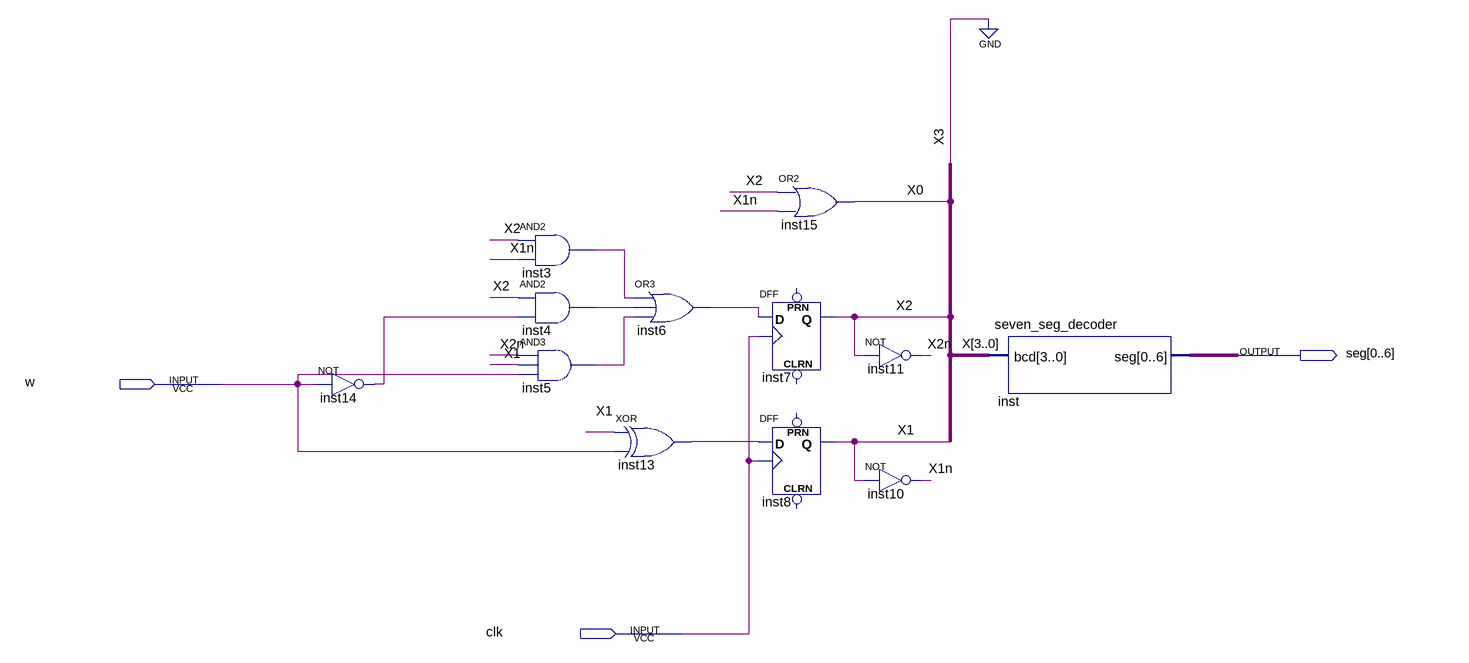
[diagram p0: schematic sheet]
// Quartus schematic lab11partb.bdf as structural Verilog: 12 symbols, 3 pins
module lab11partb (
  input  w,
  input  clk,
  output [0:6] seg
);

  wire inst3_out, inst4_out, inst5_out, inst6_out, inst13_out, inst14_out, X1n, X2n;
  wire [2:0] X;

  not inst14 (inst14_out, w);
  and inst3 (inst3_out, X[2], X1n);
  and inst4 (inst4_out, X[2], inst14_out);
  and inst5 (inst5_out, X2n, X[1], w);
  or inst6 (inst6_out, inst3_out, inst4_out, inst5_out);
  xor inst13 (inst13_out, X[1], w);
  DFF inst7 (.CLK(clk), .D(inst6_out), .Q(X[2]));  // open: CLRN, PRN
  DFF inst8 (.CLK(clk), .D(inst13_out), .Q(X[1]));  // open: CLRN, PRN
  or inst15 (X[0], X[2], X1n);
  not inst11 (X2n, X[2]);
  not inst10 (X1n, X[1]);
  seven_seg_decoder inst (.bcd({1'b0, X}), .seg(seg));
endmodule
